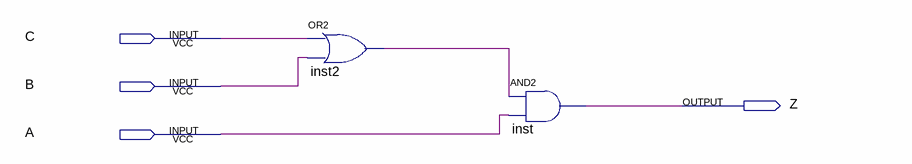
[diagram p0: schematic sheet]
// Quartus schematic ex2.bdf as structural Verilog: 2 symbols, 4 pins
module ex2 (
  input  C,
  input  B,
  input  A,
  output Z
);

  wire inst2_out;

  or inst2 (inst2_out, C, B);
  and inst (Z, inst2_out, A);
endmodule
